# EAGLE design relays (EAGLE 8.3.1)
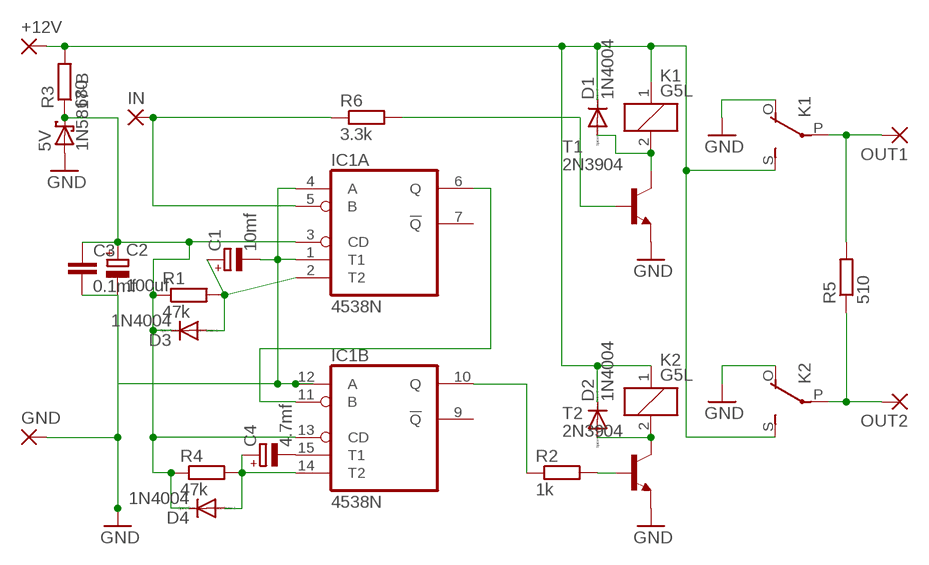
[diagram p0: schematic, sheet 1]

## Parts
5V  1N5817-B  [DO41-7.6]
+12V  3,81/1,1  [3,81/1,1]
C1  10mf  CPOL-EUE2,5-6E  [E2,5-6E]
C2  100uf  CPOL-EUE2,5-6E  [E2,5-6E]
C3  0.1mf  C-EU050-024X044  [C050-024X044]
C4  4.7mf  CPOL-EUE2,5-6E  [E2,5-6E]
D1  1N4004  [DO41-10]
D2  1N4004  [DO41-10]
D3  1N4004  [DO41-10]
D4  1N4004  [DO41-10]
GND  3,81/1,1  [3,81/1,1]
IC1  4538N  [DIL16]
IN  3,81/1,1  [3,81/1,1]
K1  G5L  [G5LE]
K2  G5L  [G5LE]
OUT1  3,81/1,1  [3,81/1,1]
OUT2  3,81/1,1  [3,81/1,1]
R1  47k  R-EU_0207/7  [0207/7]
R2  1k  R-EU_0207/7  [0207/7]
R3  680  R-EU_0207/7  [0207/7]
R4  47k  R-EU_0207/7  [0207/7]
R5  510  R-EU_0207/7  [0207/7]
R6  3.3k  R-EU_0207/7  [0207/7]
T1  2N3904  [TO92]
T2  2N3904  [TO92]

## Nets
GND: 5V.A C1.- C2.- C3.2 GND.1(P) IC1.1(A:T1) IC1.4(A:A) IC1.12(B:A) K1.O(2:O) K2.O(2:O) T1.3(E) T2.3(E)
N$1: D1.A K1.2 T1.1(C)
N$2: +12V.1(P) D1.C D2.C K1.1 K1.S(2:S) K2.1 K2.S(2:S) R3.2
N$3: IC1.5(A:B) IN.1(P) R6.1
N$4: D2.A K2.2 T2.1(C)
N$5: K1.P(2:P) OUT1.1(P) R5.2
N$6: C1.+ D3.A IC1.2(A:T2) R1.2
N$7: C4.- IC1.15(B:T1)
N$8: IC1.6(A:Q) IC1.11(B:B)
N$9: R2.2 T2.2(B)
N$10: K2.P(2:P) OUT2.1(P) R5.1
N$11: IC1.10(B:Q) R2.1
N$12: C4.+ D4.A IC1.14(B:T2) R4.2
N$13: R6.2 T1.2(B)
VDD: 5V.C C2.+ C3.1 D3.C D4.C IC1.3(A:CD) IC1.13(B:CD) R1.1 R3.1 R4.1
Unconnected: IC1.7(A:!Q) IC1.9(B:!Q)

## Power pins joined to a net without a drawn wire
VDD: IC1.16(P:VDD)
VSS: IC1.8(P:VSS)

## Library data of the parts
5V = diode:1N581*: 1.0A SCHOTTKY BARRIER RECTIFIER Source: http://www.diodes.com/datasheets/ds23001.pdf
+12V GND IN OUT1 OUT2 = wirepad:3,81/1,1: THROUGH-HOLE PAD
C1 C2 C4 = resistor:CPOL-EU: POLARIZED CAPACITOR, European symbol
C3 = resistor:C-EU: CAPACITOR, European symbol
D1-D4 = diode:1N4004: DIODE general purpose rectifier, 1 A
IC1 = 45xx:4538: Dual precision monostable MULTIVIBRATOR
K1 K2 = relay:G5L: RELAY 1 x switch, 10 A/120 V AC, 8 A/30 V ADC, Omron; OC_FARNELL: unknown; OC_NEWARK: unknown
R1-R6 = resistor:R-EU_: RESISTOR, European symbol
T1 T2 = transistor:2N3904: NPN TRANSISTOR

## Board
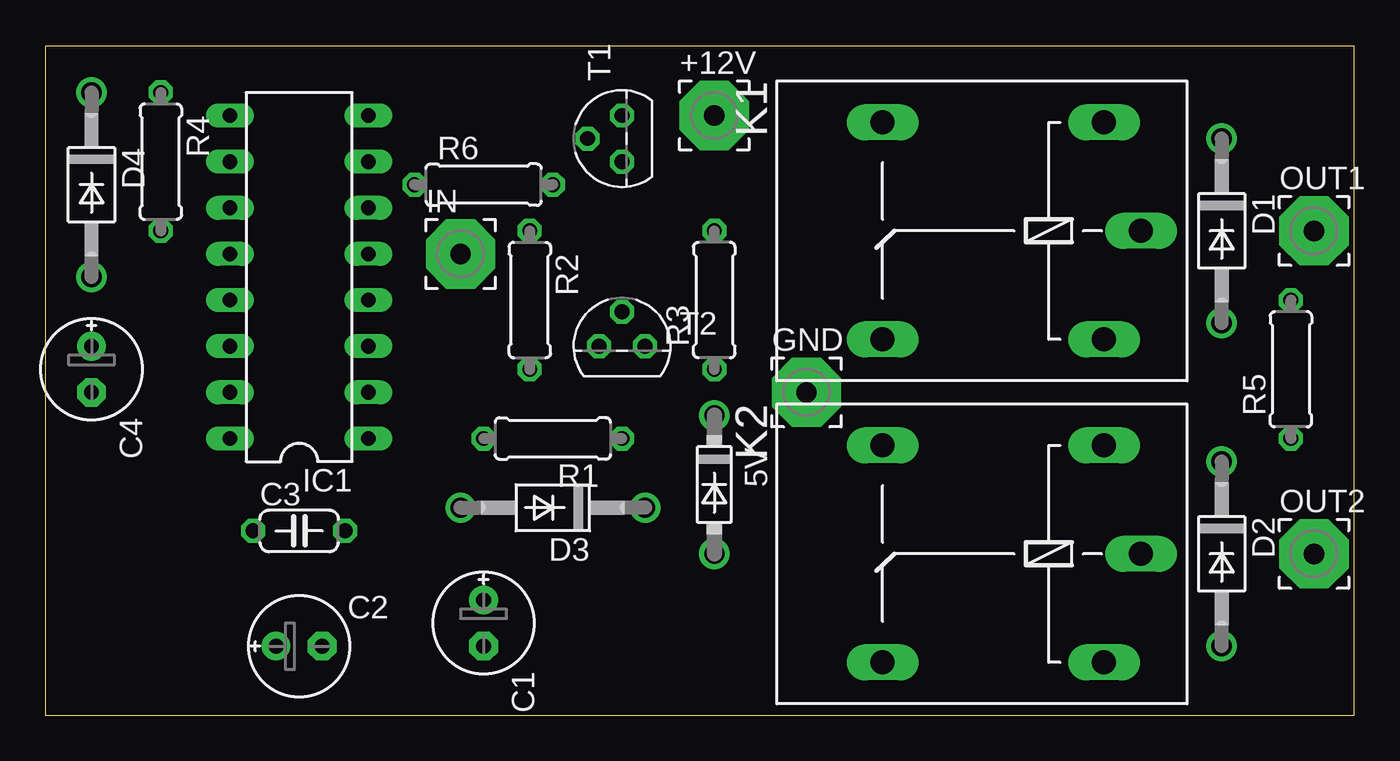
[diagram p1: board, top side]
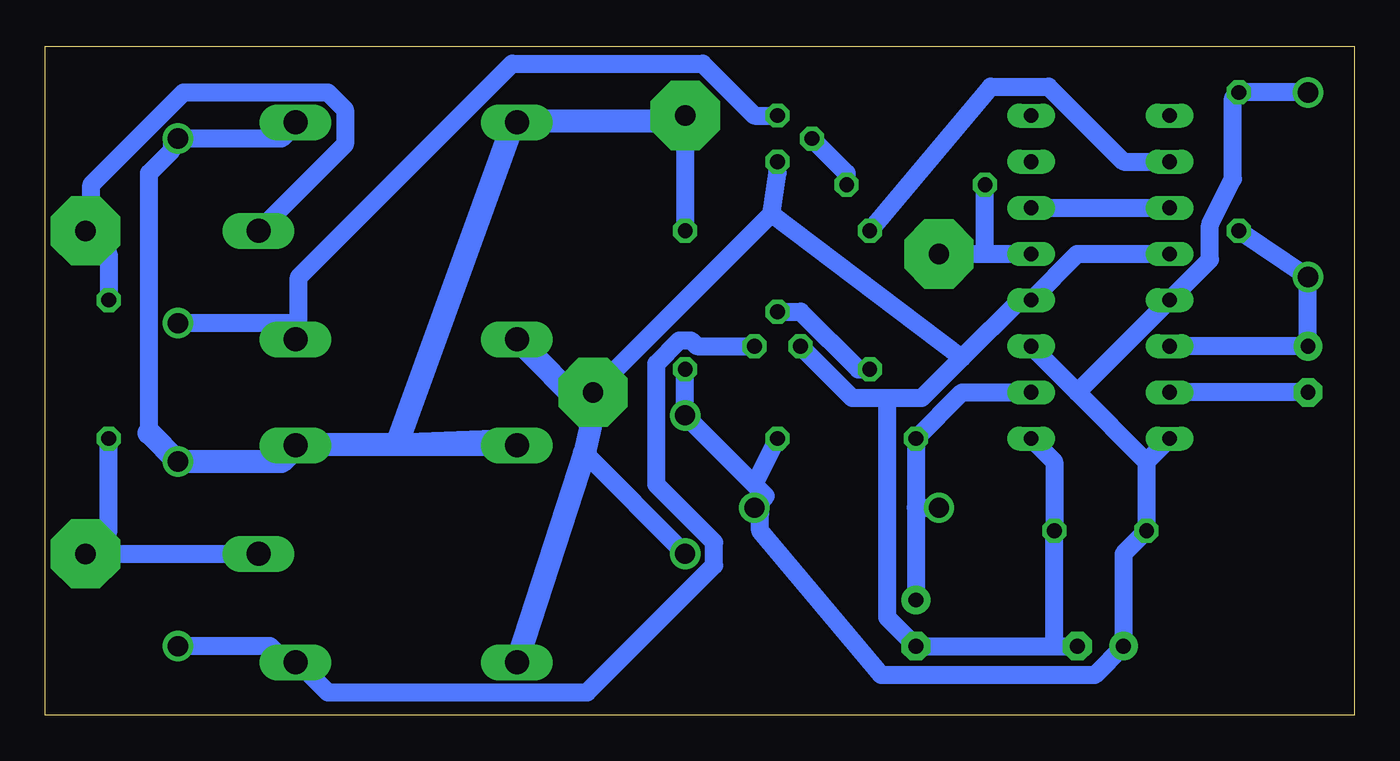
[diagram p2: board, bottom side, seen from below]

Size 72.06 x 36.82 mm. Coordinates in mm from the lower left corner, seen from the top.
Outline: 0,0 72.06,0 72.06,36.82 0,36.82 0,0
Copper layers (1*16): Top 0.035mm / dielectric 1.5mm / Bottom 0.035mm
Design rules "default *": minimum track width 1mm, minimum drill 0.35mm, track to track 6mil, track to pad 6mil, pad to pad 6mil, via to via 6mil, smd to smd 6mil, copper to edge 1mm, drill to drill 6mil, minimum pad ring 10mil, minimum via ring 8mil, stop-mask expansion 4mil, vias tented up to drill 0mil, thermal gap 10mil

### Footprints (pad centres in the part's own frame; a part is rotated, then mirrored left to right if it is on the bottom)
DO41-7.6 = drill 1.1 pad 1.7: A 3.81,0; C -3.81,0
3,81/1,1 = drill 1.118 pad 3.81 octagon: 1 0,0
E2,5-6E = drill 0.813 pad 1.575: + -1.27,0 | drill 0.813 pad 1.575 octagon: - 1.27,0
C050-024X044 = drill 0.813 octagon: 1 -2.54,0; 2 2.54,0
DO41-10 = drill 1.118: A 5.08,0; C -5.08,0
DIL16 = drill 0.813 long: 1 -8.89,-3.81; 2 -6.35,-3.81; 3 -3.81,-3.81; 4 -1.27,-3.81; 5 1.27,-3.81; 6 3.81,-3.81; 7 6.35,-3.81; 8 8.89,-3.81; 9 8.89,3.81; 10 6.35,3.81; 11 3.81,3.81; 12 1.27,3.81; 13 -1.27,3.81; 14 -3.81,3.81; 15 -6.35,3.81; 16 -8.89,3.81
G5LE = drill 1.321 long: 1 -7.493,-5.969; 2 -7.493,5.969; O 4.699,5.969; P -9.525,0; S 4.699,-5.969
0207/7 = drill 0.813 octagon: 1 -3.81,0; 2 3.81,0
TO92 = drill 0.813 octagon: 1 1.27,0; 2 0,1.905; 3 -1.27,0

### Placement (x,y rotation side)
5V  36.83,12.7 270 top
+12V  36.83,33.02 0 top
C1  24.13,5.08 270 top
C2  13.97,3.81 0 top
C3  13.97,10.16 0 top
C4  2.54,19.05 270 top
D1  64.77,26.67 270 top
D2  64.77,8.89 270 top
D3  27.94,11.43 180 top
D4  2.54,29.21 270 top
GND  41.91,17.78 0 top
IC1  13.97,24.13 90 top
IN  22.86,25.4 0 top
K1  50.8,26.67 180 top
K2  50.8,8.89 180 top
OUT1  69.85,26.67 0 top
OUT2  69.85,8.89 0 top
R1  27.94,15.24 180 top
R2  26.67,22.86 270 top
R3  36.83,22.86 90 top
R4  6.35,30.48 270 top
R5  68.58,19.05 90 top
R6  24.13,29.21 0 top
T1  31.75,31.75 90 top
T2  31.75,20.32 0 top

### Tracks (layer width: path | path; a pad name or v marks a point on that pad's centre or on a via)
GND
  Bottom 1: 42.39,14.45 5V.A | GND.1 41.91,16.51 | 46.04,3.18 K2.O | 42.23,16.83 GND.1 | IC1.1 16.51,13.97 C3.2 16.51,3.81 | 16.51,3.81 C1.- 25.72,5.4 25.72,17.46 | 16.51,3.81 C2.- | T2.3 27.62,17.46 25.72,17.46 | 25.72,17.46 23.81,17.46 21.59,19.69 | 21.59,19.69 18.41,22.86 IC1.4 15.24,25.4 IC1.12 | T1.3 31.75,29.85 32.07,27.62 | 21.59,19.69 32.07,27.62 | 32.07,27.62 GND.1
  Bottom 1.27: 41.91,16.51 42.39,14.45 46.04,3.18 | 42.23,16.83 K1.O
N$1
  Bottom 1: T1.1 33.02,33.02 35.88,35.88 46.35,35.88 58.1,24.13 58.1,20.95 K1.2 58.42,21.59 D1.A
N$2
  Bottom 1: R3.2 +12V.1 37.15,32.7 | 46.04,32.7 K1.S 46.35,32.38 | K1.1 58.42,32.38 59.05,31.75 D1.C 65.09,31.43 65.09,31.12 66.36,29.85 66.36,15.56 | 58.42,14.61 K2.1 58.1,14.92 | 46.35,14.92 K2.S | 52.71,14.92 47.31,15.24 54.93,14.92
  Bottom 1.27: 37.15,32.7 46.04,32.7 | 58.42,14.61 59.05,13.97 D2.C 66.36,15.56 | 58.1,14.92 54.93,14.92 52.71,14.92 | 52.71,14.92 46.35,14.92 | 52.71,14.92 46.35,32.38
N$3
  Bottom 1: IN.1 20.32,25.4 | 20.32,25.4 IC1.5 | 20.32,25.4 R6.1
N$4
  Bottom 1: T2.1 36.2,20.32 36.51,20.64 37.15,20.64 38.42,19.37 38.42,12.7 35.24,9.52 35.24,8.26 42.23,1.27 56.51,1.27 58.1,2.86 K2.2 58.74,2.86 59.69,3.81 D2.A
N$5
  Bottom 1: R5.2 68.58,25.4 OUT1.1 69.53,26.99 69.53,29.21 64.45,34.29 56.51,34.29 55.56,33.34 55.56,31.43 K1.P
N$6
  Bottom 1: IC1.2 21.59,17.78 R1.2 24.13,11.43 | 24.13,11.43 C1.+ | 24.13,11.43 D3.A
N$7
  Bottom 1: C4.- IC1.15
N$8
  Bottom 1: IC1.6 IC1.11
N$9
  Bottom 1: R2.2 27.3,19.05 30.48,22.23 T2.2
N$10
  Bottom 1: R5.1 68.58,10.16 OUT2.1 K2.P
N$11
  Bottom 1: IC1.10 12.7,30.48 16.83,34.61 20,34.61 R2.1
N$12
  Bottom 1: IC1.14 C4.+ D4.A R4.2
N$13
  Bottom 1: R6.2 27.94,29.85 T1.2
VDD
  Bottom 1: R3.1 5V.C 33.02,12.7 | 33.02,12.7 R1.1 | 33.02,12.7 32.38,12.06 D3.C 32.7,11.11 32.7,10.16 26.03,2.22 14.29,2.22 C2.+ 12.7,8.89 C3.1 11.43,13.97 | D4.C R4.1 6.67,33.97 6.67,29.53 7.94,26.99 7.94,25.08 IC1.13 15.24,17.78 | IC1.16 11.43,13.97 | 11.43,13.97 15.24,17.78 | 15.24,17.78 IC1.3